# Altium project PCB_301_Project.PrjPcb
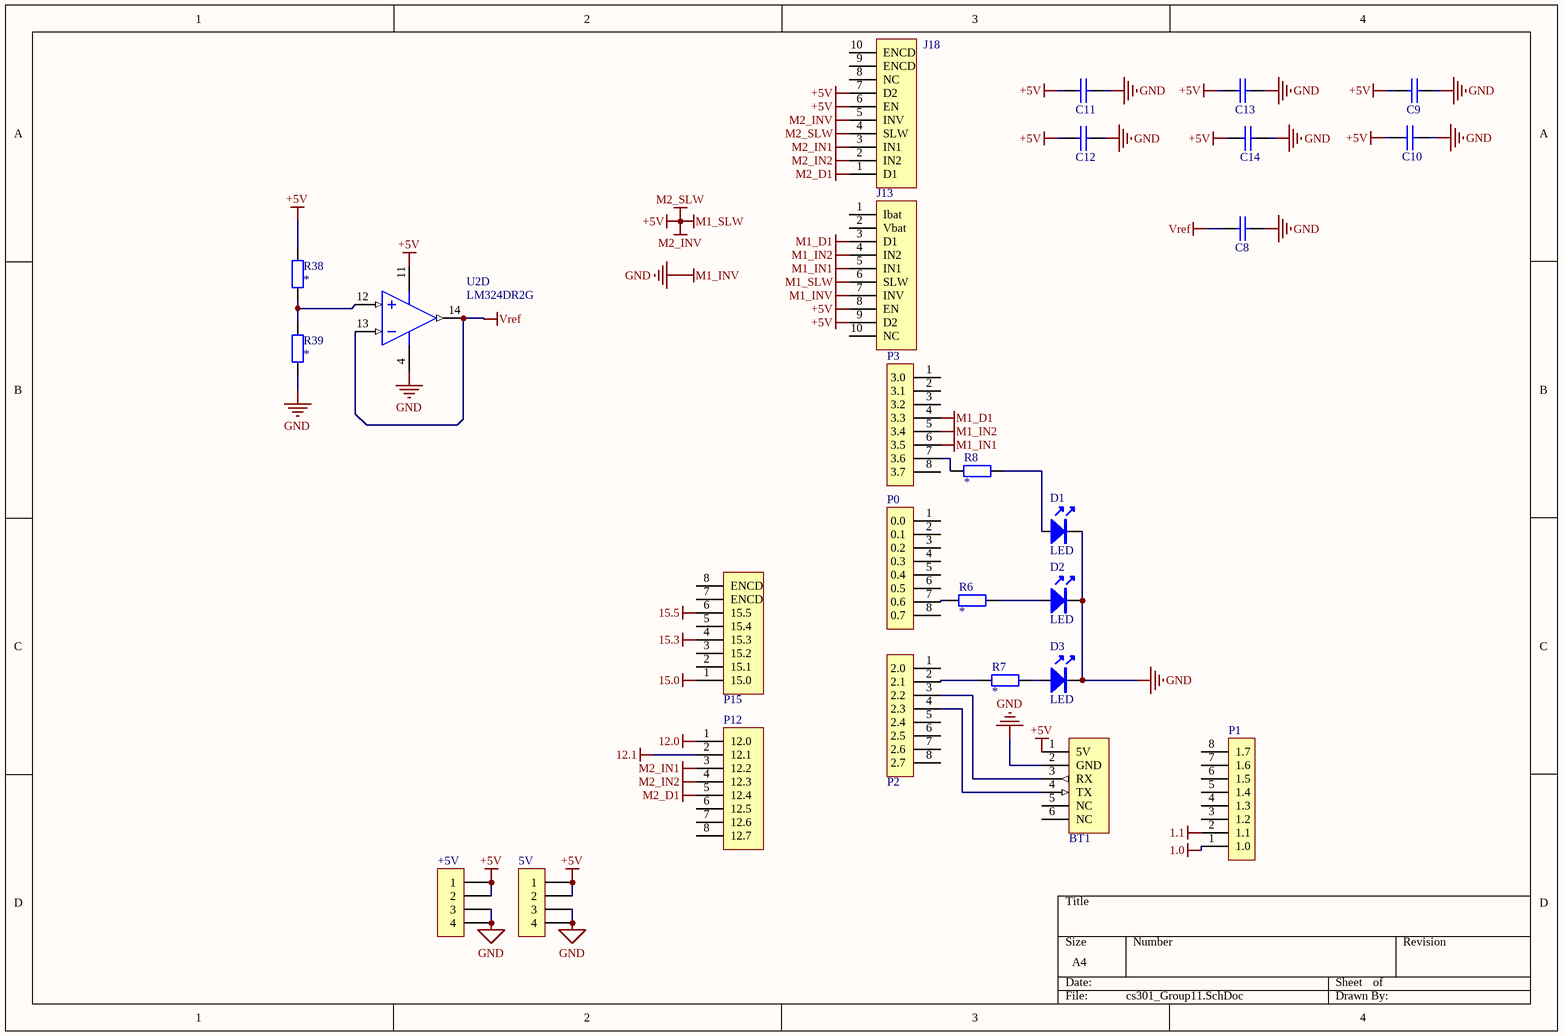
[diagram p0: cs301_Group11.SchDoc]
2 sheets, 96 parts. Net scope: global (net labels, ports and power ports of the same name join across sheets).
Board file: cs301_Group11.PcbDoc
Sheets:
  cs301_Group11.SchDoc
  Sensors.SchDoc

## Sheet cs301_Group11.SchDoc
size A4; SheetNumber: 1; SheetTotal: 2; SPICEModelCacheRPIWRWHR: <root> / <DocumentId>RPIWRWHR</DocumentId> / </root>

### Parts
(Parts that share a designator on the sheet are numbered #1, #2 ... from top to bottom, then left to right.)
5V  5V  [IDC4]  (value not drawn)
+5V  5V  [IDC4]  (value not drawn)
BT1  BLE Module Header  [HM10_HDR1X6]  (value not drawn)
C8  *  [0805 CAP]  (value not drawn)
C9  *  [0805 CAP]  (value not drawn)
C10  *  [0805 CAP]  (value not drawn)
C11  *  [0805 CAP]  (value not drawn)
C12  *  [0805 CAP]  (value not drawn)
C13  *  [0805 CAP]  (value not drawn)
C14  *  [0805 CAP]  (value not drawn)
D1  LED  [LED0.1/5MM]
D2  LED  [LED0.1/5MM]
D3  LED  [LED0.1/5MM]
J13  CON10  [idc10]  (value not drawn)
J18  CON10  [IDC10]  (value not drawn)
P0  P0  [idc8]  (value not drawn)
P1  P1  [idc8]  (value not drawn)
P2  P2  [idc8]  (value not drawn)
P3  P3  [idc8]  (value not drawn)
P12  P12  [idc8]  (value not drawn)
P15  P15  [idc8]  (value not drawn)
R6  *  [0805 RES]
R7  *  [0805 RES]
R8  *  [0805 RES]
R38  *  [0805 RES]
R39  *  [0805 RES]
U2#1  LM324DR2G  [SOIC-14]  (part D of 4)

### Nets
1.0: P1.1(1.0)
1.1: P1.2(1.1)
12.0: P12.1(12.0)
12.1: P12.2(12.1)
15.0: P15.1(15.0)
15.3: P15.4(15.3)
15.5: P15.6(15.5)
+5V: 5V.1 5V.2 +5V.1 +5V.2 BT1.1(5V) C9.2 C10.1 C11.1 C12.1 C13.1 C14.1 J13.6(SLW) J13.8(EN) J13.9(D2) J18.4(SLW) J18.5(INV) J18.6(EN) J18.7(D2) R38.2 U2#1.11(VEE/GND)  [also labelled M1_SLW, M2_INV, M2_SLW]
GND: 5V.3 5V.4 +5V.3 +5V.4 BT1.2(GND) C8.2 C9.1 C10.2 C11.2 C12.2 C13.2 C14.2 D1.K D2.K D3.K J13.7(INV) R39.1 U2#1.4(VCC)  [also labelled M1_INV]
M1_D1: J13.3(D1) P3.4(3.3)
M1_IN1: J13.5(IN1) P3.6(3.5)
M1_IN2: J13.4(IN2) P3.5(3.4)
M2_D1: J18.1(D1) P12.5(12.4)
M2_IN1: J18.3(IN1) P12.3(12.2)
M2_IN2: J18.2(IN2) P12.4(12.3)
Vref: C8.1 U2#1.13(IN4-) U2#1.14(OUT4)
NetBT1_3: BT1.3(RX) P2.3(2.2)
NetBT1_4: BT1.4(TX) P2.4(2.3)
NetD1_A: D1.A R8.1
NetD2_A: D2.A R6.2
NetD3_A: D3.A R7.1
NetP0_7: P0.7(0.6) R6.1
NetP2_2: P2.2(2.1) R7.2
NetP3_7: P3.7(3.6) R8.2
NetR38_1: R38.1 R39.2 U2#1.12(IN4+)

Not connected (* = marked no-connect by the designer): BT1 5(NC) 6(NC); J13 1(Ibat) 2(Vbat) 10(NC); J18 8(NC) 9(ENCD) 10(ENCD); P0 1(0.0) 2(0.1) 3(0.2) 4(0.3) 5(0.4) 6(0.5) 8(0.7); P1 3(1.2) 4(1.3) 5(1.4) 6(1.5) 7(1.6) 8(1.7); P2 1(2.0) 5(2.4) 6(2.5) 7(2.6) 8(2.7); P3 1(3.0) 2(3.1) 3(3.2) 8(3.7); P12 6(12.5) 7(12.6) 8(12.7); P15 2(15.1) 3(15.2) 5(15.4) 7(ENCD) 8(ENCD)

### Notes on the sheet
- Labels drawn without touching a wire or pin: +5V

### Library data of the parts
5V +5V = CON4: Connector
BT1 = BLEModule_TH: 2.54mm pitch 6-pin header for BLE module; LatestRevisionDate: 17-Jul-2002; LatestRevisionNote: Re-released for DXP Platform.; Publisher: Altium Limited
C8-C14 = CerCap_SMT_0805: SMT ceramic capacitor 0805 size; Value: *
J13 J18 = CON10: Connector
P0-P3 = CON8: Connector
P12 P15 = CON8_1: Connector
R6-R8 R38 R39 = Res_SMT_0805: 0805 resistor; Published: 8-Jun-2000; LatestRevisionDate: 17-Jul-2002; LatestRevisionNote: Re-released for DXP Platform.; PackageReference: AXIAL-0.4; Publisher: Altium Limited; Value: *; ComponentLink1Description: https://nz.mouser.com/datasheet/2/315/AOA0000C304-1149620.pdf
U2#1 = LM324DR_SMT_SOIC16: Single Supply Quad Operational Amplifier, 3 to 32 V, 0 to 70 degC, 14-Pin SOIC, Pb-Free, Tape and Reel; Manufacturer: On Semiconductor; VCC Max (V): 32; VCC Min (V): 3; PackageVersion: Rev. K, 05/2011; ComponentLink3URL: http://www.onsemi.com/pub_link/Collateral/751A-03.PDF; ComponentLink3Description: Package Specification; Packing: Tape and Reel; ComponentLink2URL: http://www.onsemi.cn/pub_link/Collateral/LM324-D.PDF; PackageReference: SOIC-14-751A-03; ComponentLink1URL: http://www.onsemi.com/; PackageDescription: 14-Pin Small Outline Integrated Circuit, Body 8.65 x 3.9 mm, Pitch 1.27 mm; ComponentLink1Description: Manufacturer URL; DatasheetVersion: Rev. 25; Mounting Technology: Surface Mount; RoHS: TRUE; ComponentLink2Description: Datasheet; PartNumber: LM324DR2G

## Sheet Sensors.SchDoc
size A4; SheetNumber: 2; SheetTotal: 2
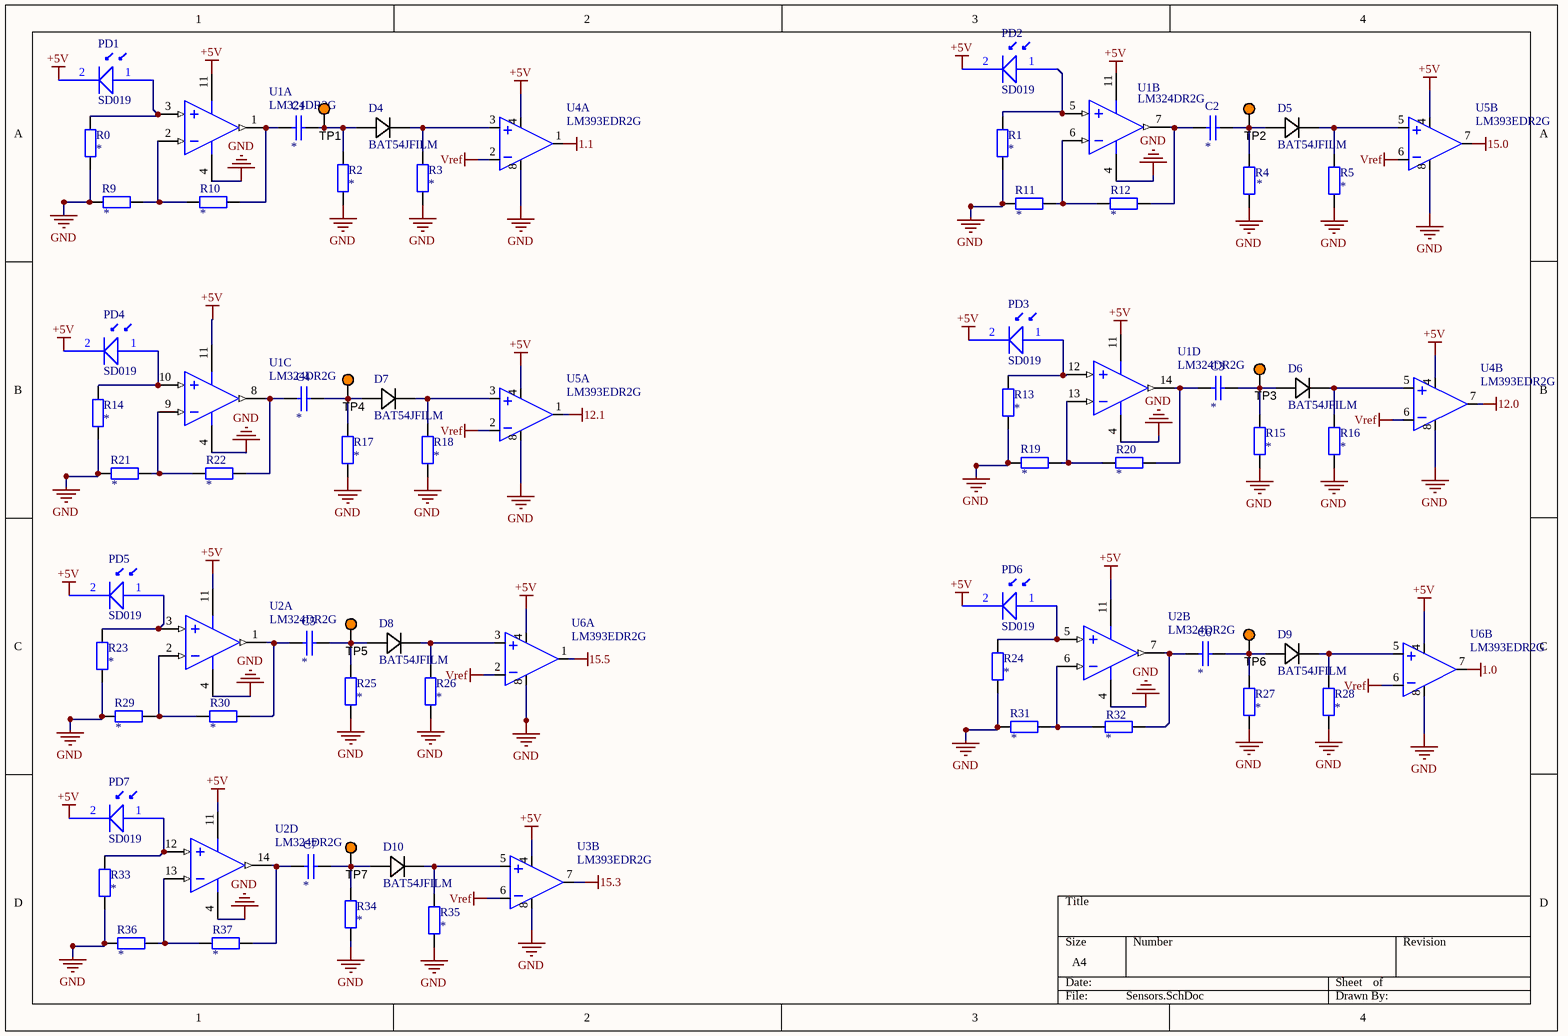
[diagram p1: Sensors.SchDoc]

### Parts
(Parts that share a designator on the sheet are numbered #1, #2 ... from top to bottom, then left to right.)
C1  *  [0805 CAP]
C2  *  [0805 CAP]
C3  *  [0805 CAP]
C4  *  [0805 CAP]
C5  *  [0805 CAP]
C6  *  [0805 CAP]
C7  *  [0805 CAP]
D4  BAT54JFILM  [CR_SOD323_BAT54_STM]
D5  BAT54JFILM  [CR_SOD323_BAT54_STM]
D6  BAT54JFILM  [CR_SOD323_BAT54_STM]
D7  BAT54JFILM  [CR_SOD323_BAT54_STM]
D8  BAT54JFILM  [CR_SOD323_BAT54_STM]
D9  BAT54JFILM  [CR_SOD323_BAT54_STM]
D10  BAT54JFILM  [CR_SOD323_BAT54_STM]
PD1  SD019  [SD019]
PD2  SD019  [SD019]
PD3  SD019  [SD019]
PD4  SD019  [SD019]
PD5  SD019  [SD019]
PD6  SD019  [SD019]
PD7  SD019  [SD019]
R0  *  [0805 RES]
R1  *  [0805 RES]
R2  *  [0805 RES]
R3  *  [0805 RES]
R4  *  [0805 RES]
R5  *  [0805 RES]
R9  *  [0805 RES]
R10  *  [0805 RES]
R11  *  [0805 RES]
R12  *  [0805 RES]
R13  *  [0805 RES]
R14  *  [0805 RES]
R15  *  [0805 RES]
R16  *  [0805 RES]
R17  *  [0805 RES]
R18  *  [0805 RES]
R19  *  [0805 RES]
R20  *  [0805 RES]
R21  *  [0805 RES]
R22  *  [0805 RES]
R23  *  [0805 RES]
R24  *  [0805 RES]
R25  *  [0805 RES]
R26  *  [0805 RES]
R27  *  [0805 RES]
R28  *  [0805 RES]
R29  *  [0805 RES]
R30  *  [0805 RES]
R31  *  [0805 RES]
R32  *  [0805 RES]
R33  *  [0805 RES]
R34  *  [0805 RES]
R35  *  [0805 RES]
R36  *  [0805 RES]
R37  *  [0805 RES]
TP1  5003  [TP_TH]  (value not drawn)
TP2  5003  [TP_TH]  (value not drawn)
TP3  5003  [TP_TH]  (value not drawn)
TP4  5003  [TP_TH]  (value not drawn)
TP5  5003  [TP_TH]  (value not drawn)
TP6  5003  [TP_TH]  (value not drawn)
TP7  5003  [TP_TH]  (value not drawn)
U1  LM324DR2G  [SOIC-14]  (parts A,B,C,D of 4)
U2#1  LM324DR2G  [SOIC-14]  (parts A,B of 4)
U2#2  LM324DR2G  [SOIC-14]  (part D of 4)
U3  LM393EDR2G  [SOIC8_4X5_ONS]  (part B of 2)
U4  LM393EDR2G  [SOIC8_4X5_ONS]  (parts A,B of 2)
U5  LM393EDR2G  [SOIC8_4X5_ONS]  (parts A,B of 2)
U6  LM393EDR2G  [SOIC8_4X5_ONS]  (parts A,B of 2)

### Nets
1.0: U6.7
1.1: U4.1
12.0: U4.7
12.1: U5.1
15.0: U5.7
15.3: U3.7
15.5: U6.1
+5V: PD1.2 PD2.2 PD3.2 PD4.2 PD5.2 PD6.2 PD7.2 U1.11(VEE/GND) U2#1.11(VEE/GND) U2#2.11(VEE/GND) U3.4 U4.4 U5.4 U6.4
GND: R0.1 R1.1 R2.1 R3.1 R4.1 R5.1 R9.2 R11.2 R13.1 R14.1 R15.1 R16.1 R17.1 R18.1 R19.2 R21.2 R23.1 R24.1 R25.1 R26.1 R27.1 R28.1 R29.2 R31.2 R33.1 R34.1 R35.1 R36.2 U1.4(VCC) U2#1.4(VCC) U2#2.4(VCC) U3.8 U4.8 U5.8 U6.8
Vref: U3.6 U4.2 U4.6 U5.2 U5.6 U6.2 U6.6
NetC1_1: C1.1 R10.2 U1.1(OUT1)
NetC1_2: C1.2 D4.1 R2.2 TP1.1
NetC2_1: C2.1 R12.2 U1.7(OUT2)
NetC2_2: C2.2 D5.1 R4.2 TP2.1
NetC3_1: C3.1 R20.2 U1.14(OUT4)
NetC3_2: C3.2 D6.1 R15.2 TP3.1
NetC4_1: C4.1 R22.2 U1.8(OUT3)
NetC4_2: C4.2 D7.1 R17.2 TP4.1
NetC5_1: C5.1 R30.2 U2#1.1(OUT1)
NetC5_2: C5.2 D8.1 R25.2 TP5.1
NetC6_1: C6.1 R32.2 U2#1.7(OUT2)
NetC6_2: C6.2 D9.1 R27.2 TP6.1
NetC7_1: C7.1 R37.2 U2#2.14(OUT4)
NetC7_2: C7.2 D10.1 R34.2 TP7.1
NetD4_2: D4.2 R3.2 U4.3
NetD5_2: D5.2 R5.2 U5.5
NetD6_2: D6.2 R16.2 U4.5
NetD7_2: D7.2 R18.2 U5.3
NetD8_2: D8.2 R26.2 U6.3
NetD9_2: D9.2 R28.2 U6.5
NetD10_2: D10.2 R35.2 U3.5
NetPD1_1: PD1.1 R0.2 U1.3(IN1+)
NetPD2_1: PD2.1 R1.2 U1.5(IN2+)
NetPD3_1: PD3.1 R13.2 U1.12(IN4+)
NetPD4_1: PD4.1 R14.2 U1.10(IN3+)
NetPD5_1: PD5.1 R23.2 U2#1.3(IN1+)
NetPD6_1: PD6.1 R24.2 U2#1.5(IN2+)
NetPD7_1: PD7.1 R33.2 U2#2.12(IN4+)
NetR9_1: R9.1 R10.1 U1.2(IN1-)
NetR11_1: R11.1 R12.1 U1.6(IN2-)
NetR19_1: R19.1 R20.1 U1.13(IN4-)
NetR21_1: R21.1 R22.1 U1.9(IN3-)
NetR29_1: R29.1 R30.1 U2#1.2(IN1-)
NetR31_1: R31.1 R32.1 U2#1.6(IN2-)
NetR36_1: R36.1 R37.1 U2#2.13(IN4-)

### Notes on the sheet
- Labels drawn without touching a wire or pin: +5V

### Library data of the parts
C1-C7 = CerCap_SMT_0805: SMT ceramic capacitor 0805 size; Value: *
D4-D10 = BAT54JFILM: No Description Available; Mfr_Name: STMicroelectronics
R0-R5 R9-R37 = Res_SMT_0805: 0805 resistor; Published: 8-Jun-2000; LatestRevisionDate: 17-Jul-2002; LatestRevisionNote: Re-released for DXP Platform.; PackageReference: AXIAL-0.4; Publisher: Altium Limited; Value: *; ComponentLink1Description: https://nz.mouser.com/datasheet/2/315/AOA0000C304-1149620.pdf
TP1-TP7 = TestPoint: Test Point, Orange, 1-Pin THD, RoHS; Peak Reverse Current: 600 uA; Forward Current: 3 A; Max Surge Current: 80 A; Forward Voltage: 1.08 V; Max Operating Temperature: 150 degC; PackageReference: 5003; Pins: 2; ComponentLink2URL: http://keyelco.com/userAssets/file/M65p56.pdf; PackageDescription: 1-Pin Through Hole Device, Dia 2.54 mm; Weight: 0.01 lb; Diameter: 5.3 mm; Mount: Through Hole; Package Quantity: 500; Packaging: Bulk; Min Operating Temperature: -65 degC; ComponentLink1Description: Manufacturer URL; Height: 0.25 inch; ComponentLink1URL: http://www.keyelco.com/; ComponentLink2Description: Datasheet; Width: 0.25 inch; REACH SVHC: No SVHC; RoHSCompliant: true; Radiation Hardening: No; Length: 9.5 mm; DatasheetVersion: Jun-15
U1 U2#1 U2#2 = LM324DR_SMT_SOIC16: as U2#1 on sheet cs301_Group11; PackageVersion: Rev. K, 05/2011; ComponentLink3URL: http://www.onsemi.com/pub_link/Collateral/751A-03.PDF; ComponentLink3Description: Package Specification; Packing: Tape and Reel; ComponentLink2URL: http://www.onsemi.cn/pub_link/Collateral/LM324-D.PDF; PackageReference: SOIC-14-751A-03; ComponentLink1URL: http://www.onsemi.com/; PackageDescription: 14-Pin Small Outline Integrated Circuit, Body 8.65 x 3.9 mm, Pitch 1.27 mm; ComponentLink1Description: Manufacturer URL; DatasheetVersion: Rev. 25; Mounting Technology: Surface Mount; RoHS: TRUE; ComponentLink2Description: Datasheet; PartNumber: LM324DR2G

## Nets that join several sheets
1.0: cs301_Group11 (P1.1), Sensors (U6.7)
1.1: cs301_Group11 (P1.2), Sensors (U4.1)
12.0: cs301_Group11 (P12.1), Sensors (U4.7)
12.1: cs301_Group11 (P12.2), Sensors (U5.1)
15.0: cs301_Group11 (P15.1), Sensors (U5.7)
15.3: cs301_Group11 (P15.4), Sensors (U3.7)
15.5: cs301_Group11 (P15.6), Sensors (U6.1)
+5V: cs301_Group11 (20 pins), Sensors (14 pins)
GND: cs301_Group11 (18 pins), Sensors (35 pins)
Vref: cs301_Group11 (C8.1 U2#1.13 U2#1.14), Sensors (7 pins)